# EAGLE schematic PISTA (EAGLE 9.6.2)
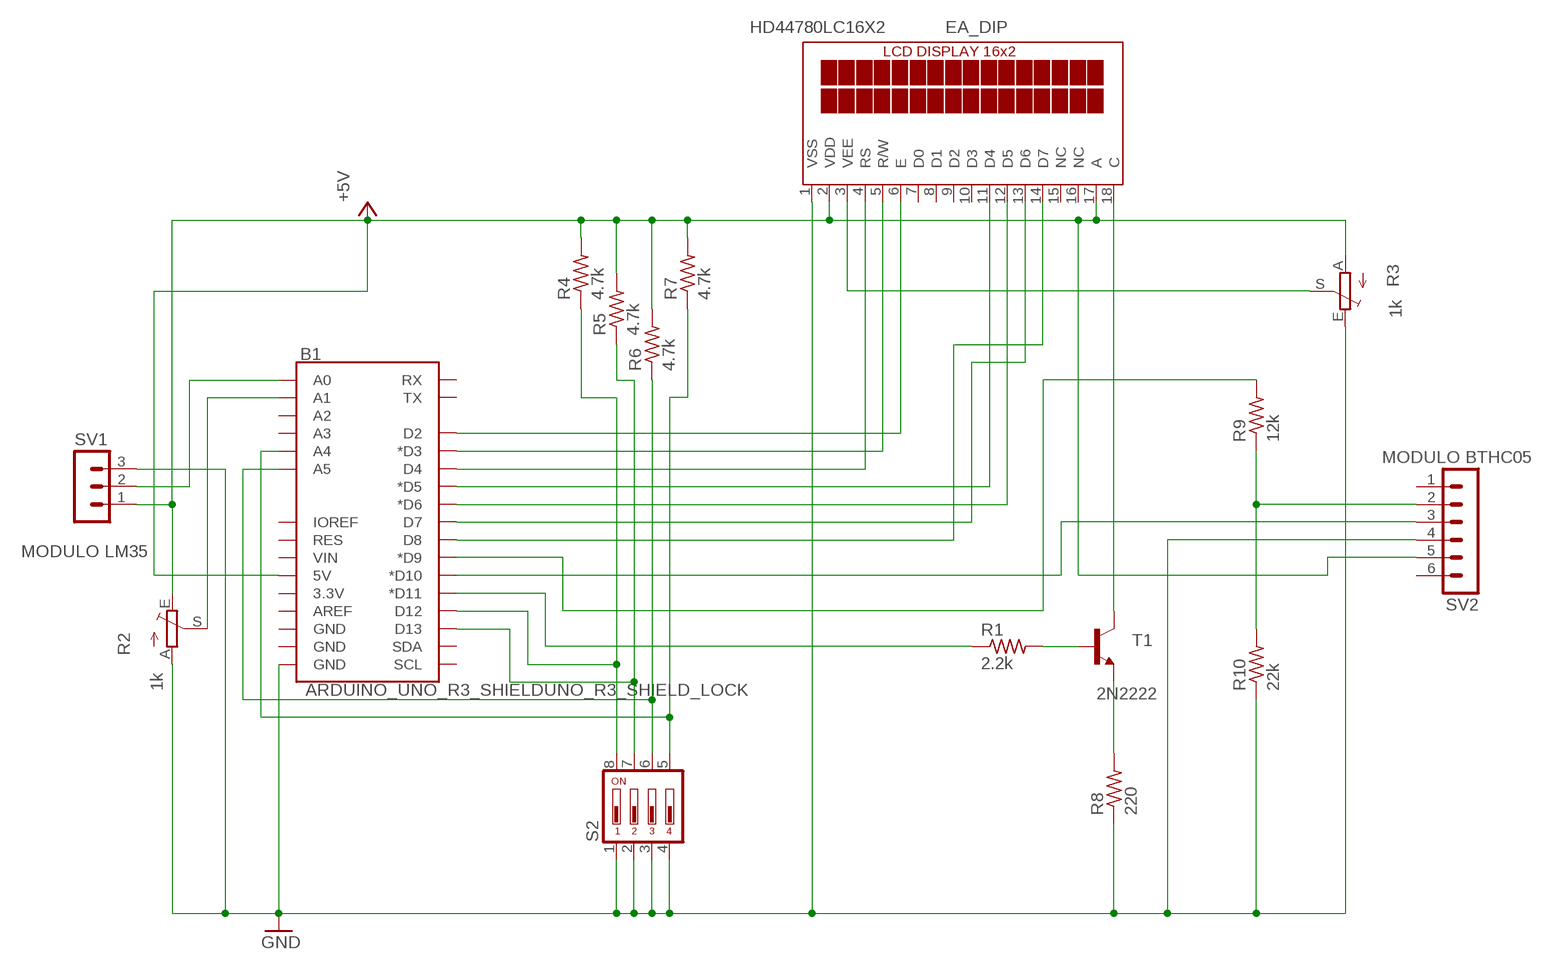
[diagram p0: schematic, sheet 1]

## Parts
B1  ARDUINO_UNO_R3_SHIELDUNO_R3_SHIELD_LOCK  [UNO_R3_SHIELD_LOCK]
HD44780LC16X2  EA_DIP  [EA_DIP]
R1  2.2k  R-US_0207/10  [0207/10]
R2  1k  TRIM_EU-B25P  [B25P]
R3  1k  TRIM_EU-B25P  [B25P]
R4  4.7k  R-US_0207/10  [0207/10]
R5  4.7k  R-US_0207/10  [0207/10]
R6  4.7k  R-US_0207/10  [0207/10]
R7  4.7k  R-US_0207/10  [0207/10]
R8  220  R-US_0207/10  [0207/10]
R9  12k  R-US_0207/10  [0207/10]
R10  22k  R-US_0207/10  [0207/10]
S2  SD4-04  [SD4-04]
SV1  MODULO LM35  MA03-1  [MA03-1]
SV2  MODULO BTHC05  MA06-1  [MA06-1]
T1  2N2222  [TO18]

## Nets
+5V: B1.5V HD44780LC16X2.2(VDD) HD44780LC16X2.17(A) R2.E R3.A R4.2 R5.2 R6.2 R7.2 SV1.1 SV2.5
GND: B1.GND@0(GND) HD44780LC16X2.1(VSS) R2.A R3.E R8.1 R10.1 S2.1 S2.2 S2.3 S2.4 SV1.3 SV2.4
N$1: B1.D12 R4.1 S2.8
N$2: B1.A1 R2.S
N$3: B1.A0 SV1.2
N$4: B1.D13 R5.1 S2.7
N$5: B1.A5 R6.1 S2.6
N$6: B1.A4 R7.1 S2.5
N$7: R8.2 T1.1(E)
N$8: R1.2 T1.2(B)
N$9: HD44780LC16X2.18(C) T1.3(C)
N$10: R9.1 R10.2 SV2.2
N$11: HD44780LC16X2.3(VEE) R3.S
N$12: B1.D11(*D11) R1.1
N$13: B1.D9(*D9) R9.2
N$14: B1.D10(*D10) SV2.3
N$15: B1.D2 HD44780LC16X2.6(E)
N$16: B1.D3(*D3) HD44780LC16X2.5(R/W)
N$17: B1.D4 HD44780LC16X2.4(RS)
N$18: B1.D5(*D5) HD44780LC16X2.11(D4)
N$19: B1.D6(*D6) HD44780LC16X2.12(D5)
N$20: B1.D7 HD44780LC16X2.13(D6)
N$21: B1.D8 HD44780LC16X2.14(D7)
Unconnected: B1.3.3V B1.A2 B1.A3 B1.AREF B1.GND@1(GND) B1.GND@2(GND) B1.IOREF B1.RES B1.RX B1.SCL B1.SDA B1.TX B1.VIN HD44780LC16X2.7(D0) HD44780LC16X2.8(D1) HD44780LC16X2.9(D2) HD44780LC16X2.10(D3) HD44780LC16X2.15(NC) HD44780LC16X2.16(NC) SV2.1 SV2.6

## Library data of the parts
B1 = SparkFun-Boards:ARDUINO_UNO_R3_SHIELD: Arduino R3 Shield Footprint Shield form compatible with the Arduino Uno R3. SparkFun Products: MG2639 Cellular Shield <https://www.sparkfun.com/products/13120> MIDI Shield <https://www.sparkfun.com/products/12898> R3 Stackable Headers Kit <https://www.sparkfun.com/products/11417>
HD44780LC16X2 = display-lcd:EA_DIP: LCD-MODUL 2x16 - 6,68mm, INKL. KONTROLLER HD44780 Source: Data sheet <http://www.lcd-module.de/pdf/doma/dip162-d.pdf>
R1 R4-R10 = rcl:R-US_: RESISTOR, American symbol; SPICEPREFIX: R
R2 R3 = pot:TRIM_EU-: POTENTIOMETER
S2 = switch-dil:SD4-04: DIL/CODE SWITCH; OC_FARNELL: unknown; OC_NEWARK: unknown
SV1 = con-lstb:MA03-1: PIN HEADER; OC_FARNELL: unknown; OC_NEWARK: unknown
SV2 = con-lstb:MA06-1: PIN HEADER; OC_FARNELL: unknown; OC_NEWARK: unknown
T1 = transistor:2N2222: NPN TRANSISTOR